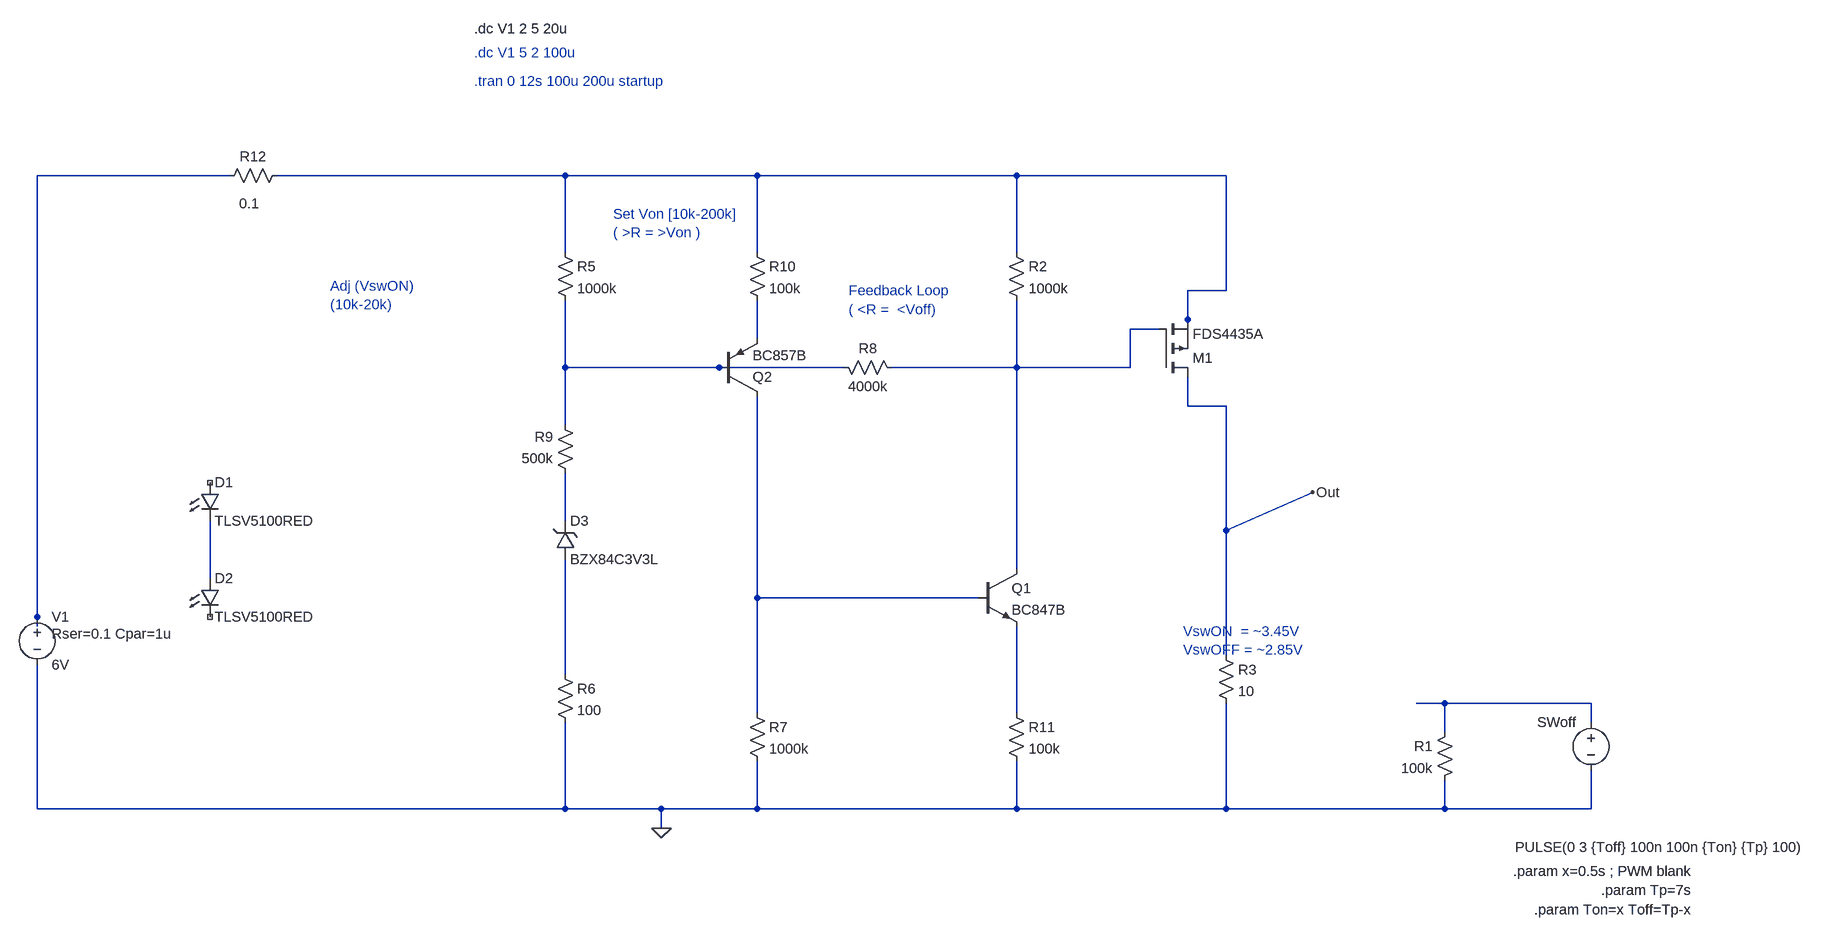
[diagram p0: schematic V0_SW20p.asc]
V0_SW20p.asc, the LTspice schematic file:
Version 4
SHEET 1 2884 752
WIRE -480 -560 -800 -560
WIRE 352 -560 -400 -560
WIRE 672 -560 352 -560
WIRE 1104 -560 672 -560
WIRE 1520 -560 1104 -560
WIRE 352 -432 352 -560
WIRE 672 -432 672 -560
WIRE 1104 -432 1104 -560
WIRE 1520 -368 1520 -560
WIRE 1520 -368 1456 -368
WIRE 1456 -320 1456 -368
WIRE 1408 -304 1360 -304
WIRE 672 -288 672 -352
WIRE 1456 -272 1456 -320
WIRE 352 -240 352 -352
WIRE 608 -240 352 -240
WIRE 816 -240 608 -240
WIRE 1104 -240 1104 -352
WIRE 1104 -240 896 -240
WIRE 1360 -240 1360 -304
WIRE 1360 -240 1104 -240
WIRE 1456 -176 1456 -224
WIRE 1520 -176 1456 -176
WIRE 352 -144 352 -240
WIRE 352 16 352 -64
WIRE 1520 32 1520 -176
WIRE 1520 32 1664 -32
WIRE 1104 96 1104 -240
WIRE -512 112 -512 16
WIRE 672 144 672 -192
WIRE 1040 144 672 144
WIRE -800 176 -800 -560
WIRE -800 192 -800 176
WIRE 1520 240 1520 32
WIRE 352 272 352 80
WIRE 2256 320 2208 320
WIRE 2528 320 2256 320
WIRE 672 336 672 144
WIRE 1104 336 1104 192
WIRE 2528 352 2528 320
WIRE 2256 368 2256 320
WIRE -800 496 -800 256
WIRE 352 496 352 352
WIRE 352 496 -800 496
WIRE 512 496 352 496
WIRE 672 496 672 416
WIRE 672 496 512 496
WIRE 1104 496 1104 416
WIRE 1104 496 672 496
WIRE 1520 496 1520 320
WIRE 1520 496 1104 496
WIRE 2256 496 2256 448
WIRE 2256 496 1520 496
WIRE 2528 496 2528 432
WIRE 2528 496 2256 496
WIRE 512 528 512 496
FLAG 512 528 0
FLAG 1664 -32 Out
SYMBOL res 336 -448 R0
SYMATTR InstName R5
SYMATTR Value 1000k
SYMBOL res 1504 224 R0
SYMATTR InstName R3
SYMATTR Value 10
SYMBOL voltage -800 160 R0
WINDOW 123 0 0 Left 0
WINDOW 39 24 44 Left 2
SYMATTR SpiceLine Rser=0.1 Cpar=1u
SYMATTR InstName V1
SYMATTR Value 6V
SYMBOL pnp 608 -192 M180
SYMATTR InstName Q2
SYMATTR Value BC857B
SYMBOL res 656 320 R0
SYMATTR InstName R7
SYMATTR Value 1000k
SYMBOL npn 1040 96 R0
SYMATTR InstName Q1
SYMATTR Value BC847B
SYMBOL res 1088 -448 R0
SYMATTR InstName R2
SYMATTR Value 1000k
SYMBOL res 800 -256 M90
WINDOW 0 0 56 VBottom 2
WINDOW 3 32 56 VTop 2
SYMATTR InstName R8
SYMATTR Value 4000k
SYMBOL res 368 -48 R180
WINDOW 0 36 76 Left 2
WINDOW 3 36 40 Left 2
SYMATTR InstName R9
SYMATTR Value 500k
SYMBOL res 656 -448 R0
SYMATTR InstName R10
SYMATTR Value 100k
SYMBOL res -384 -576 R90
WINDOW 0 0 56 VBottom 2
WINDOW 3 47 62 VTop 2
SYMATTR InstName R12
SYMATTR Value 0.1
SYMBOL res 1088 320 R0
SYMATTR InstName R11
SYMATTR Value 100k
SYMBOL LED -528 -48 R0
SYMATTR InstName D1
SYMATTR Value TLSV5100RED
SYMBOL LED -528 112 R0
SYMATTR InstName D2
SYMATTR Value TLSV5100RED
SYMBOL zener 336 80 M180
WINDOW 0 24 64 Left 2
WINDOW 3 24 0 Left 2
SYMATTR InstName D3
SYMATTR Value BZX84C3V3L
SYMATTR Description Diode
SYMATTR Type diode
SYMBOL res 336 256 R0
SYMATTR InstName R6
SYMATTR Value 100
SYMBOL pmos 1408 -224 M180
SYMATTR InstName M1
SYMATTR Value FDS4435A
SYMBOL voltage 2528 336 M0
WINDOW 3 -353 224 Left 2
WINDOW 123 0 0 Left 0
WINDOW 39 0 0 Left 0
SYMATTR Value PULSE(0 3 {Toff} 100n 100n {Ton} {Tp} 100)
SYMATTR InstName SWoff
SYMBOL res 2272 352 M0
SYMATTR InstName R1
SYMATTR Value 100k
TEXT 200 -872 Left 2 !.dc V1 2 5 20u
TEXT 200 -832 Left 2 ;.dc V1 5 2 100u
TEXT 432 -496 Left 2 ;Set Von [10k-200k]\n( >R = >Von )
TEXT 824 -368 Left 2 ;Feedback Loop\n( <R =  <Voff)
TEXT 1448 200 Left 2 ;VswON  = ~3.45V\nVswOFF = ~2.85V
TEXT -312 -376 Left 2 ;Adj (VswON)\n(10k-20k)
TEXT 200 -784 Left 2 ;.tran 0 12s 100u 200u startup
TEXT 2696 600 Right 2 !.param x=0.5s ; PWM blank
TEXT 2696 664 Right 2 !.param Ton=x Toff=Tp-x
TEXT 2696 632 Right 2 !.param Tp=7s

The netlist it stands for:
* V0_SW20p.asc
R5 N002 N005 1000k
R3 Out 0 10
V1 N001 0 6V Rser=0.1 Cpar=1u
Q2 N008 N005 N004 0 BC857B
R7 N008 0 1000k
Q1 N003 N008 N011 0 BC847B
R2 N002 N003 1000k
R8 N005 N003 4000k
R9 N006 N005 500k
R10 N002 N004 100k
R12 N002 N001 0.1
R11 N011 0 100k
D1 NC_01 N007 TLSV5100RED
D2 N007 NC_02 TLSV5100RED
D3 N009 N006 BZX84C3V3L
R6 N009 0 100
M1 Out N003 N002 N002 FDS4435A
V§SWoff N010 0 PULSE(0 3 {Toff} 100n 100n {Ton} {Tp} 100)
R1 N010 0 100k
.model D D
.lib standard.dio
.model NPN NPN
.model PNP PNP
.lib standard.bjt
.model NMOS NMOS
.model PMOS PMOS
.lib standard.mos
.dc V1 2 5 20u
* .dc V1 5 2 100u
* Set Von [10k-200k]
* ( >R = >Von )
* Feedback Loop
* ( <R =  <Voff)
* VswON  = ~3.45V
* VswOFF = ~2.85V
* Adj (VswON)
* (10k-20k)
* .tran 0 12s 100u 200u startup
.param x=0.5s ; PWM blank
.param Ton=x Toff=Tp-x
.param Tp=7s
.backanno
.end